# EAGLE schematic untitled (EAGLE 9.6.2)
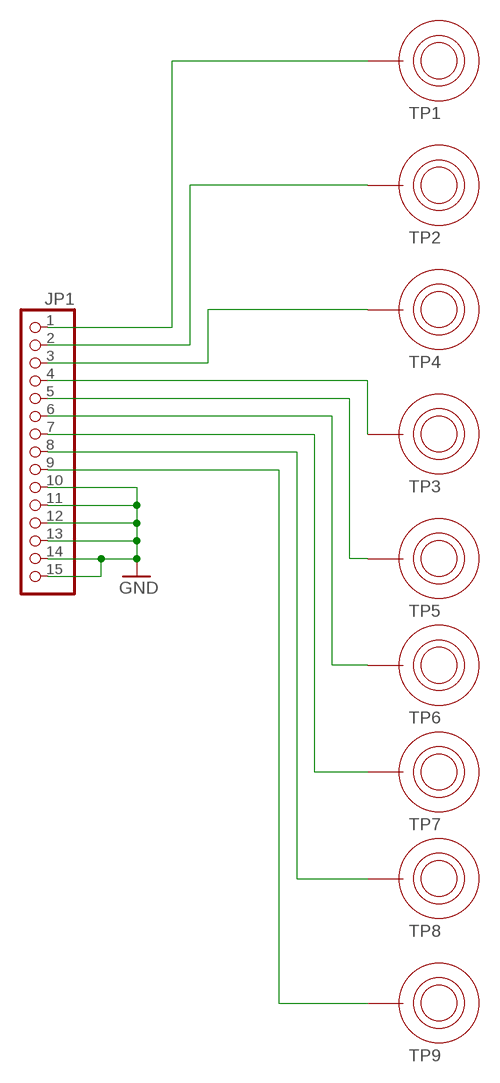
[diagram p0: schematic, sheet 1]

## Parts
JP1  PINHD-1X15  [1X15]
TP1  TOUCHPADROUND15MM  [TOUCHPAD_ROUND_15MM]
TP2  TOUCHPADROUND15MM  [TOUCHPAD_ROUND_15MM]
TP3  TOUCHPADROUND15MM  [TOUCHPAD_ROUND_15MM]
TP4  TOUCHPADROUND15MM  [TOUCHPAD_ROUND_15MM]
TP5  TOUCHPADROUND15MM  [TOUCHPAD_ROUND_15MM]
TP6  TOUCHPADROUND15MM  [TOUCHPAD_ROUND_15MM]
TP7  TOUCHPADROUND15MM  [TOUCHPAD_ROUND_15MM]
TP8  TOUCHPADROUND15MM  [TOUCHPAD_ROUND_15MM]
TP9  TOUCHPADROUND15MM  [TOUCHPAD_ROUND_15MM]

## Nets
GND: JP1.10 JP1.11 JP1.12 JP1.13 JP1.14 JP1.15
N$1: JP1.1 TP1.P$1
N$2: JP1.2 TP2.P$1
N$3: JP1.3 TP4.P$1
N$4: JP1.4 TP3.P$1
N$5: JP1.5 TP5.P$1
N$6: JP1.6 TP6.P$1
N$7: JP1.7 TP7.P$1
N$8: JP1.8 TP8.P$1
N$9: JP1.9 TP9.P$1

## Library data of the parts
JP1 = pinhead:PINHD-1X15: PIN HEADER
TP1-TP9 = SerialWombat_F360_Library:TOUCHPAD